# EAGLE schematic untitled (EAGLE 9.6.2)
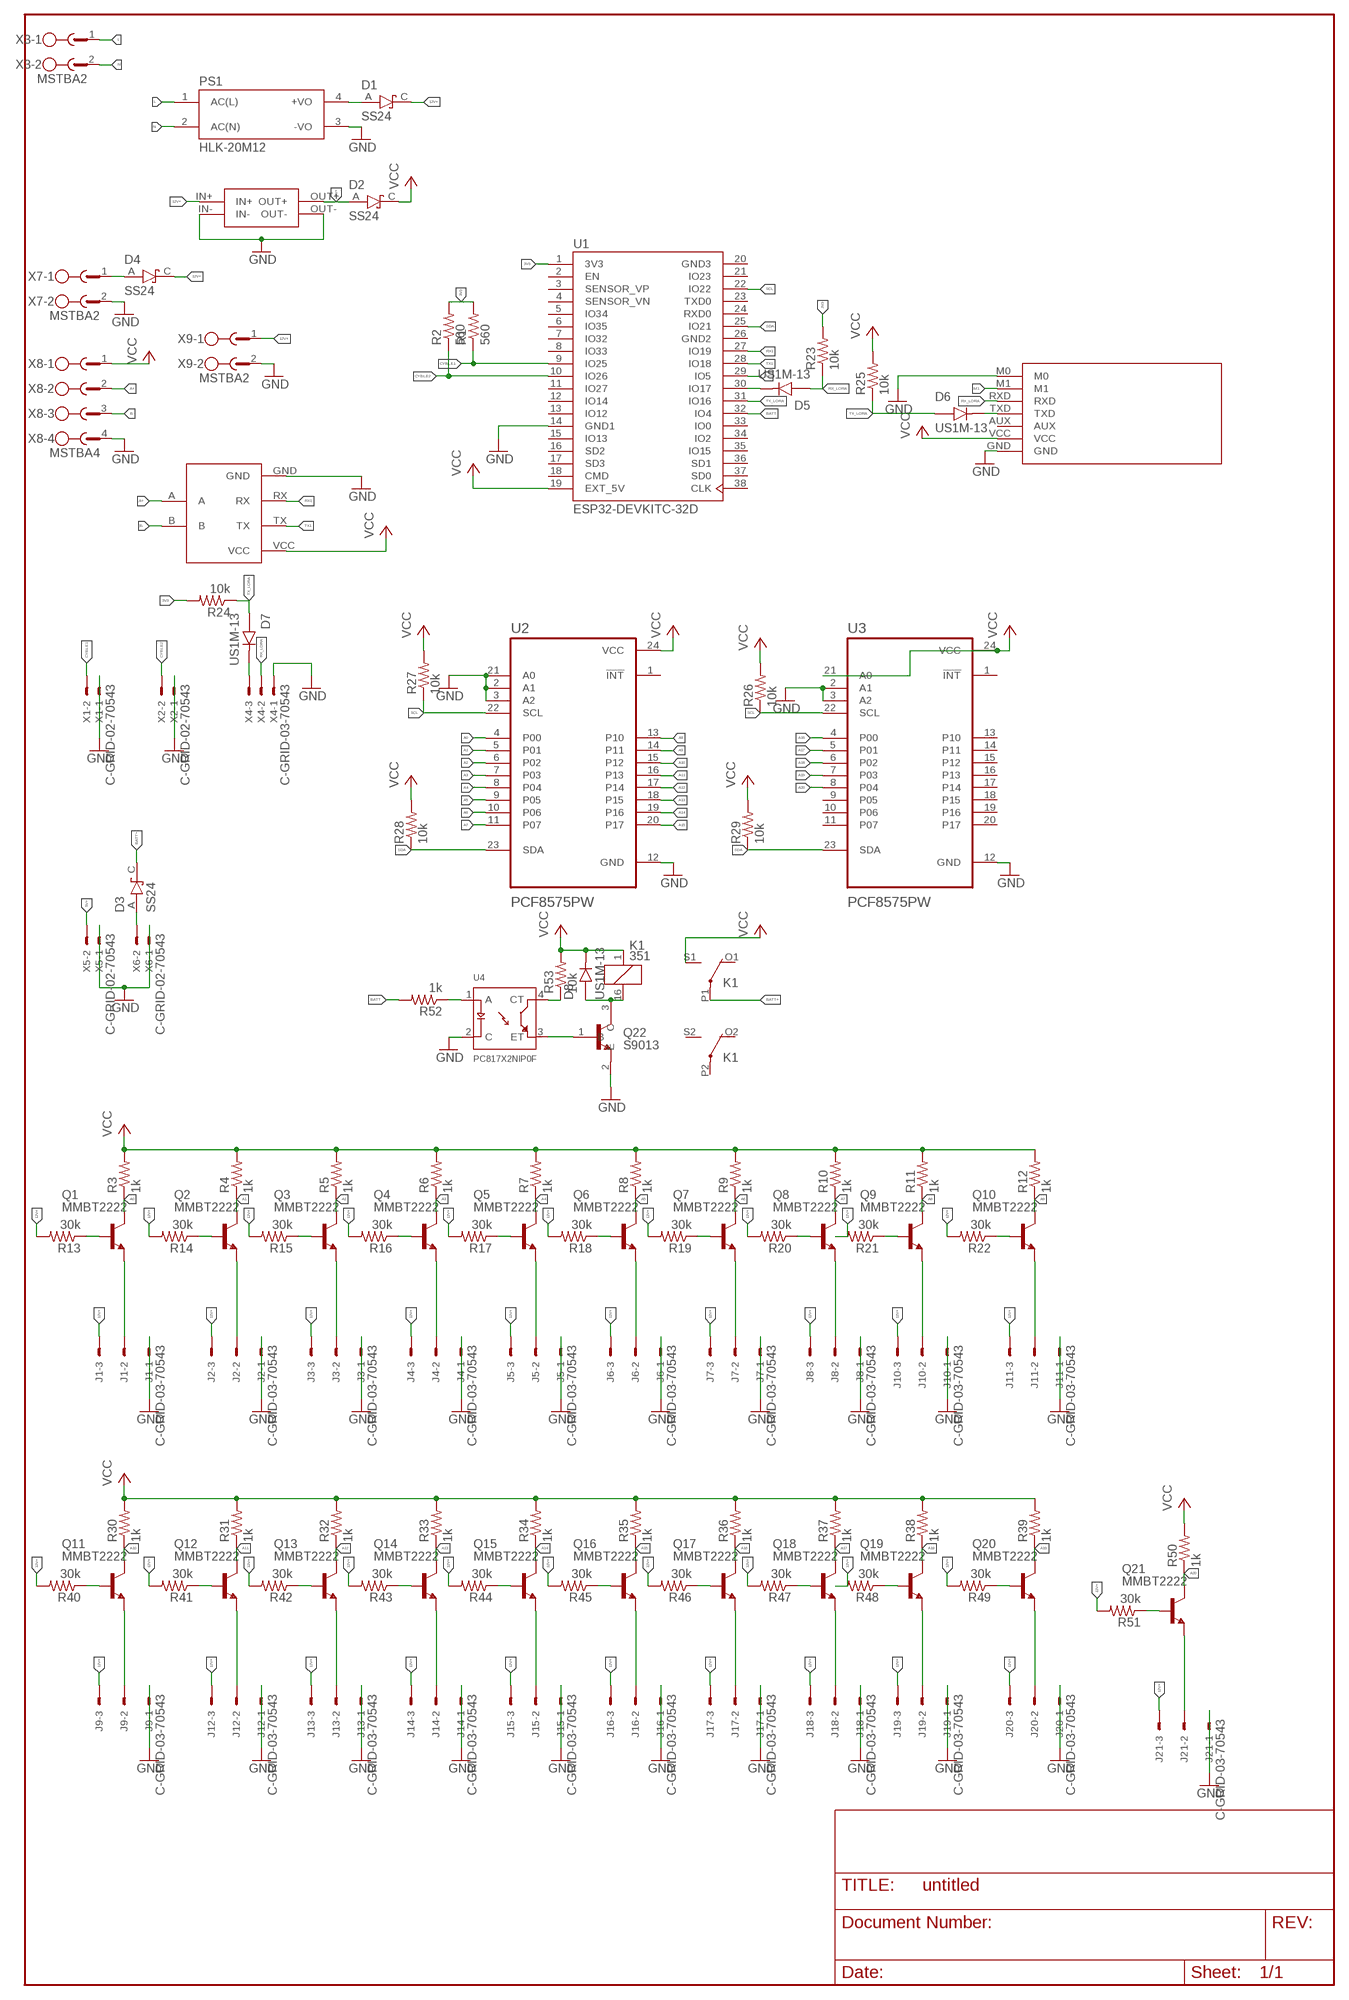
[diagram p0: schematic, sheet 1]

## Parts
D1  SS24  [DIOM5336X265N]
D2  SS24  [DIOM5336X265N]
D3  SS24  [DIOM5336X265N]
D4  SS24  [DIOM5336X265N]
D5  US1M-13  [DIOM5226X240N]
D6  US1M-13  [DIOM5226X240N]
D7  US1M-13  [DIOM5226X240N]
D8  US1M-13  [DIOM5226X240N]
EBYTEE220-900T22D1  EBYTEE220-900T22D  [EBYTEE220-900T22D]
J1  C-GRID-03-70543  [70543-03]
J2  C-GRID-03-70543  [70543-03]
J3  C-GRID-03-70543  [70543-03]
J4  C-GRID-03-70543  [70543-03]
J5  C-GRID-03-70543  [70543-03]
J6  C-GRID-03-70543  [70543-03]
J7  C-GRID-03-70543  [70543-03]
J8  C-GRID-03-70543  [70543-03]
J9  C-GRID-03-70543  [70543-03]
J10  C-GRID-03-70543  [70543-03]
J11  C-GRID-03-70543  [70543-03]
J12  C-GRID-03-70543  [70543-03]
J13  C-GRID-03-70543  [70543-03]
J14  C-GRID-03-70543  [70543-03]
J15  C-GRID-03-70543  [70543-03]
J16  C-GRID-03-70543  [70543-03]
J17  C-GRID-03-70543  [70543-03]
J18  C-GRID-03-70543  [70543-03]
J19  C-GRID-03-70543  [70543-03]
J20  C-GRID-03-70543  [70543-03]
J21  C-GRID-03-70543  [70543-03]
K1  351  [351]
MINI1  MINI560  [MINI560]
PS1  HLK-20M12  [CONV_HLK-20M12]
Q1  MMBT2222  [SOT23-BEC]
Q2  MMBT2222  [SOT23-BEC]
Q3  MMBT2222  [SOT23-BEC]
Q4  MMBT2222  [SOT23-BEC]
Q5  MMBT2222  [SOT23-BEC]
Q6  MMBT2222  [SOT23-BEC]
Q7  MMBT2222  [SOT23-BEC]
Q8  MMBT2222  [SOT23-BEC]
Q9  MMBT2222  [SOT23-BEC]
Q10  MMBT2222  [SOT23-BEC]
Q11  MMBT2222  [SOT23-BEC]
Q12  MMBT2222  [SOT23-BEC]
Q13  MMBT2222  [SOT23-BEC]
Q14  MMBT2222  [SOT23-BEC]
Q15  MMBT2222  [SOT23-BEC]
Q16  MMBT2222  [SOT23-BEC]
Q17  MMBT2222  [SOT23-BEC]
Q18  MMBT2222  [SOT23-BEC]
Q19  MMBT2222  [SOT23-BEC]
Q20  MMBT2222  [SOT23-BEC]
Q21  MMBT2222  [SOT23-BEC]
Q22  S9013  [SOT95P240X120-3N]
R1  560  R-US_M0805  [M0805]
R2  560  R-US_M0805  [M0805]
R3  1k  R-US_M0805  [M0805]
R4  1k  R-US_M0805  [M0805]
R5  1k  R-US_M0805  [M0805]
R6  1k  R-US_M0805  [M0805]
R7  1k  R-US_M0805  [M0805]
R8  1k  R-US_M0805  [M0805]
R9  1k  R-US_M0805  [M0805]
R10  1k  R-US_M0805  [M0805]
R11  1k  R-US_M0805  [M0805]
R12  1k  R-US_M0805  [M0805]
R13  30k  R-US_M0805  [M0805]
R14  30k  R-US_M0805  [M0805]
R15  30k  R-US_M0805  [M0805]
R16  30k  R-US_M0805  [M0805]
R17  30k  R-US_M0805  [M0805]
R18  30k  R-US_M0805  [M0805]
R19  30k  R-US_M0805  [M0805]
R20  30k  R-US_M0805  [M0805]
R21  30k  R-US_M0805  [M0805]
R22  30k  R-US_M0805  [M0805]
R23  10k  R-US_M0805  [M0805]
R24  10k  R-US_M0805  [M0805]
R25  10k  R-US_M0805  [M0805]
R26  10k  R-US_M0805  [M0805]
R27  10k  R-US_M0805  [M0805]
R28  10k  R-US_M0805  [M0805]
R29  10k  R-US_M0805  [M0805]
R30  1k  R-US_M0805  [M0805]
R31  1k  R-US_M0805  [M0805]
R32  1k  R-US_M0805  [M0805]
R33  1k  R-US_M0805  [M0805]
R34  1k  R-US_M0805  [M0805]
R35  1k  R-US_M0805  [M0805]
R36  1k  R-US_M0805  [M0805]
R37  1k  R-US_M0805  [M0805]
R38  1k  R-US_M0805  [M0805]
R39  1k  R-US_M0805  [M0805]
R40  30k  R-US_M0805  [M0805]
R41  30k  R-US_M0805  [M0805]
R42  30k  R-US_M0805  [M0805]
R43  30k  R-US_M0805  [M0805]
R44  30k  R-US_M0805  [M0805]
R45  30k  R-US_M0805  [M0805]
R46  30k  R-US_M0805  [M0805]
R47  30k  R-US_M0805  [M0805]
R48  30k  R-US_M0805  [M0805]
R49  30k  R-US_M0805  [M0805]
R50  1k  R-US_M0805  [M0805]
R51  30k  R-US_M0805  [M0805]
R52  1k  R-US_M0805  [M0805]
R53  10k  R-US_M0805  [M0805]
TTL-RS1  TTL-RS485  [TTL-RS485]
U1  ESP32-DEVKITC-32D  [MODULE_ESP32-DEVKITC-32D]
U2  PCF8575PW  [SOP65P640X120-24N]
U3  PCF8575PW  [SOP65P640X120-24N]
U4  PC817X2NIP0F  [SOT254P975X400-4N]
X1  C-GRID-02-70543  [70543-02]
X2  C-GRID-02-70543  [70543-02]
X3  MSTBA2  [MSTBA2]
X4  C-GRID-03-70543  [70543-03]
X5  C-GRID-02-70543  [70543-02]
X6  C-GRID-02-70543  [70543-02]
X7  MSTBA2  [MSTBA2]
X8  MSTBA4  [MSTBA4]
X9  MSTBA2  [MSTBA2]

## Nets
3V3: R1.2 R2.2 R23.2 R24.2 U1.1(3V3)
5V+: D2.A MINI1.OUT+ X5.2
12V+: D1.C(K) D4.C(K) J1.3 J2.3 J3.3 J4.3 J5.3 J6.3 J7.3 J8.3 J9.3 J10.3 J11.3 J12.3 J13.3 J14.3 J15.3 J16.3 J17.3 J18.3 J19.3 J20.3 J21.3 MINI1.IN+ R13.2 R14.2 R15.2 R16.2 R17.2 R18.2 R19.2 R20.2 R21.2 R22.2 R40.2 R41.2 R42.2 R43.2 R44.2 R45.2 R46.2 R47.2 R48.2 R49.2 R51.2 X9.1
12V++: D1.A PS1.4(+VO)
A0: Q1.C R3.1 U2.4(P00)
A1: Q2.C R4.1 U2.5(P01)
A2: Q3.C R5.1 U2.6(P02)
A3: Q4.C R6.1 U2.7(P03)
A4: Q5.C R7.1 U2.8(P04)
A5: Q6.C R8.1 U2.9(P05)
A6: Q7.C R9.1 U2.10(P06)
A7: Q8.C R10.1 U2.11(P07)
A8: Q9.C R11.1 U2.13(P10)
A9: Q10.C R12.1 U2.14(P11)
A10: Q11.C R30.1 U2.15(P12)
A11: Q12.C R31.1 U2.16(P13)
A12: Q13.C R32.1 U2.17(P14)
A13: Q14.C R33.1 U2.18(P15)
A14: Q15.C R34.1 U2.19(P16)
A15: Q16.C R35.1 U2.20(P17)
A16: Q17.C R36.1 U3.4(P00)
A17: Q18.C R37.1 U3.5(P01)
A18: Q19.C R38.1 U3.6(P02)
A19: Q20.C R39.1 U3.7(P03)
A20: Q21.C R50.1 U3.8(P04)
A+: TTL-RS1.A X8.2
B-: TTL-RS1.B X8.3
BATT: R52.2 U1.32(IO4)
BATT+: D3.C(K) K1.P1(2:P)
CYBLE1: R1.1 U1.9(IO25) X1.2
CYBLE2: R2.1 U1.10(IO26) X2.2
GND: EBYTEE220-900T22D1.GND EBYTEE220-900T22D1.M0 J1.1 J2.1 J3.1 J4.1 J5.1 J6.1 J7.1 J8.1 J9.1 J10.1 J11.1 J12.1 J13.1 J14.1 J15.1 J16.1 J17.1 J18.1 J19.1 J20.1 J21.1 MINI1.IN- MINI1.OUT- PS1.3(-VO) Q22.2(E) TTL-RS1.GND U1.14(GND1) U2.2(A1) U2.3(A2) U2.12(GND) U2.21(A0) U3.2(A1) U3.3(A2) U3.12(GND) U4.2(C) X1.1 X2.1 X4.1 X5.1 X6.1 X7.2 X8.4 X9.2
L: PS1.1(AC(L)) X3.1
M1: EBYTEE220-900T22D1.M1 U1.29(IO5)
N: PS1.2(AC(N)) X3.2
N$1: Q1.B R13.1
N$2: Q2.B R14.1
N$3: D3.A X6.2
N$4: Q3.B R15.1
N$5: Q4.B R16.1
N$6: Q5.B R17.1
N$7: Q6.B R18.1
N$8: Q7.B R19.1
N$9: Q8.B R20.1
N$10: Q9.B R21.1
N$11: Q10.B R22.1
N$12: J1.2 Q1.E
N$13: J2.2 Q2.E
N$14: J3.2 Q3.E
N$15: J4.2 Q4.E
N$16: J5.2 Q5.E
N$17: J6.2 Q6.E
N$18: J7.2 Q7.E
N$19: J8.2 Q8.E
N$20: J10.2 Q9.E
N$21: J11.2 Q10.E
N$22: D4.A X7.1
N$23: D6.C(K) EBYTEE220-900T22D1.TXD
N$24: D5.C(K) U1.30(IO17)
N$25: D7.C(K) X4.3
N$26: Q11.B R40.1
N$27: Q12.B R41.1
N$28: Q13.B R42.1
N$29: Q14.B R43.1
N$30: Q15.B R44.1
N$31: Q16.B R45.1
N$32: Q17.B R46.1
N$33: Q18.B R47.1
N$34: Q19.B R48.1
N$35: Q20.B R49.1
N$36: J9.2 Q11.E
N$37: J12.2 Q12.E
N$38: J13.2 Q13.E
N$39: J14.2 Q14.E
N$40: J15.2 Q15.E
N$41: J16.2 Q16.E
N$42: J17.2 Q17.E
N$43: J18.2 Q18.E
N$44: J19.2 Q19.E
N$45: J20.2 Q20.E
N$46: Q21.B R51.1
N$47: J21.2 Q21.E
N$48: R52.1 U4.1(A)
N$50: R53.1 U4.4(CT)
N$52: D8.A K1.16 Q22.3(C)
N$53: Q22.1(B) U4.3(ET)
RX1: TTL-RS1.RX U1.27(IO19)
RX_LORA: D5.A EBYTEE220-900T22D1.RXD R23.1 X4.2
SCL: R26.1 R27.1 U1.22(IO22) U2.22(SCL) U3.22(SCL)
SDA: R28.1 R29.1 U1.25(IO21) U2.23(SDA) U3.23(SDA)
TX1: TTL-RS1.TX U1.28(IO18)
TX_LORA: D6.A D7.A R24.1 R25.1 U1.31(IO16)
VCC: D2.C(K) D8.C(K) EBYTEE220-900T22D1.VCC K1.1 K1.S1(2:S) R3.2 R4.2 R5.2 R6.2 R7.2 R8.2 R9.2 R10.2 R11.2 R12.2 R25.2 R26.2 R27.2 R28.2 R29.2 R30.2 R31.2 R32.2 R33.2 R34.2 R35.2 R36.2 R37.2 R38.2 R39.2 R50.2 R53.2 TTL-RS1.VCC U1.19(EXT_5V) U2.24(VCC) U3.21(A0) U3.24(VCC) X8.1
Unconnected: EBYTEE220-900T22D1.AUX K1.O1(2:O) K1.O2(3:O) K1.P2(3:P) K1.S2(3:S) U1.2(EN) U1.3(SENSOR_VP) U1.4(SENSOR_VN) U1.5(IO34) U1.6(IO35) U1.7(IO32) U1.8(IO33) U1.11(IO27) U1.12(IO14) U1.13(IO12) U1.15(IO13) U1.16(SD2) U1.17(SD3) U1.18(CMD) U1.21(IO23) U1.23(TXD0) U1.24(RXD0) U1.33(IO0) U1.34(IO2) U1.35(IO15) U1.36(SD1) U1.37(SD0) U1.38(CLK) U2.1(!INT) U3.1(!INT) U3.9(P05) U3.10(P06) U3.11(P07) U3.13(P10) U3.14(P11) U3.15(P12) U3.16(P13) U3.17(P14) U3.18(P15) U3.19(P16) U3.20(P17)

## Power pins joined to a net without a drawn wire
GND2: U1.26(GND2)
GND3: U1.20(GND3)

## Library data of the parts
D1-D4 = SS24:SS24: Diode Schottky 40V 2A Surface Mount DO-214AA (SMB) Check availability <https://pricing.snapeda.com/parts/SS24/ON%20Semiconductor/view-part?ref=eda>; AVAILABILITY: In Stock; CHECK_PRICES: https://www.snapeda.com/parts/SS24/Onsemi/view-part/?ref=eda; DESCRIPTION: Diode Schottky 40V 2A Surface Mount DO-214AA (SMB); MF: ON Semiconductor; MP: SS24; PACKAGE: DO-214AA ON Semiconductor; PRICE: None; SNAPEDA_LINK: https://www.snapeda.com/parts/SS24/Onsemi/view-part/?ref=snap
D5-D8 = US1M-13:US1M-13: Diode, Fast Recovery, 1a, 1kv, Do-214ac-2, Full Reel Check availability <https://pricing.snapeda.com/parts/US1M-13/Diodes%20Incorporated/view-part?ref=eda>; AVAILABILITY: In Stock; DESCRIPTION: Diode Standard 1000 V 1A Surface Mount SMA; MF: Diodes Incorporated; MP: US1M-13; PACKAGE: DO-214AC-214 Diodes Incorporated; PRICE: None; PURCHASE-URL: https://pricing.snapeda.com/search/part/US1M-13/?ref=eda
EBYTEE220-900T22D1 = EByte E220-900T22D:EBYTEE220-900T22D
J1-J21 X4 = con-molex:C-GRID-03: CONNECTOR wire to board 2.54 mm (0.100") pitch header; MF: MOLEX; OC_FARNELL: unknown; OC_NEWARK: unknown
K1 = relay:351: RELAY 2 x switch, Omron; OC_FARNELL: unknown; OC_NEWARK: unknown
MINI1 = MINI560:MINI560
PS1 = HLK-20M12:HLK-20M12: Check availability <https://pricing.snapeda.com/parts/HLK-20M12/Hi-link/view-part?ref=eda>; AVAILABILITY: Not in stock; CHECK_PRICES: https://www.snapeda.com/parts/HLK-20M12/Hi-link/view-part/?ref=eda; DESCRIPTION: 20W ultra-small series module power supply; MF: Hi-link; MP: HLK-20M12; PACKAGE: Non-Standard Hi-link; PRICE: None; SNAPEDA_LINK: https://www.snapeda.com/parts/HLK-20M12/Hi-link/view-part/?ref=snap
Q1-Q21 = MMBT2222_:MMBT2222*: NPN Transistor Check availability <https://pricing.snapeda.com/parts/MMBT2222/ON%20Semiconductor/view-part?ref=eda>; AVAILABILITY: In Stock; CHECK_PRICES: https://www.snapeda.com/parts/MMBT2222/Onsemi/view-part/?ref=eda; DESCRIPTION: Bipolar (BJT) Transistor NPN 30 V 600 mA 250MHz 300 mW Surface Mount SOT-23-3 (TO-236); MF: ON Semiconductor; MP: MMBT2222; PACKAGE: SOT-23-3 Fairchild Semiconductor; PRICE: None; SNAPEDA_LINK: https://www.snapeda.com/parts/MMBT2222/Onsemi/view-part/?ref=snap
Q22 = S9013:S9013: SMD Transistors NPN 25V-500mA Check availability <https://pricing.snapeda.com/parts/S9013/JCET/view-part?ref=eda>; AVAILABILITY: In Stock; DESCRIPTION: Bipolar (BJT) Transistor NPN 20V 500mA 625mW Through Hole TO-92-3; MF: JCET; MP: S9013; PACKAGE: SOT-23-3 JCET; PRICE: None; PURCHASE-URL: https://pricing.snapeda.com/search/part/S9013/?ref=eda
R1-R53 = rcl:R-US_: RESISTOR, American symbol; SPICEPREFIX: R
TTL-RS1 = TTL-RS485:TTL-RS485
U1 = ESP32-DEVKITC-32D:ESP32-DEVKITC-32D: Eval Board For Esp-Wroom-32 Check availability <https://pricing.snapeda.com/parts/ESP32-DEVKITC-32D/Espressif%20Systems/view-part?ref=eda>; AVAILABILITY: In Stock; DESCRIPTION: WiFi Development Tools (802.11) ESP32 General Development Kit, ESP32-WROOM-32D on the board; MF: Espressif Systems; MP: ESP32-DEVKITC-32D; PACKAGE: None; PRICE: None; PURCHASE-URL: https://pricing.snapeda.com/search/part/ESP32-DEVKITC-32D/?ref=eda
U2 U3 = PCF8575PW:PCF8575PW: Check availability <https://pricing.snapeda.com/parts/PCF8575PW/Texas%20Instruments/view-part?ref=eda>; AVAILABILITY: In Stock; CHECK_PRICES: https://www.snapeda.com/parts/PCF8575PW/Texas+Instruments/view-part/?ref=eda; DESCRIPTION: 16-bit 2.5- to 5.5-V I2C/SMBus I/O expander with interrupt; MF: Texas Instruments; MP: PCF8575PW; PACKAGE: TSSOP-24 Texas Instruments; PRICE: None; PURCHASE-URL: https://www.snapeda.com/api/url_track_click_mouser/?unipart_id=1203644&manufacturer=Texas Instruments&part_name=PCF8575PW&search_term=pcf8575; SNAPEDA_LINK: https://www.snapeda.com/parts/PCF8575PW/Texas+Instruments/view-part/?ref=snap
U4 = PC817X2NIP0F:PC817X2NIP0F: PC817 Series 1 Channel 80 V 5000 Vrms General Purpose Photocoupler - DIP-4 Check availability <https://pricing.snapeda.com/parts/PC817X2NIP0F/Sharp%20Microelectronics/view-part?ref=eda>; AVAILABILITY: Not in stock; DESCRIPTION: Optoisolator Transistor Output 5000Vrms 1 Channel 4-SMD; MF: Sharp Microelectronics; MP: PC817X2NIP0F; PACKAGE: SMD-4 Sharp Microelectronics; PRICE: None
X1 X2 X5 X6 = con-molex:C-GRID-02: CONNECTOR wire to board 2.54 mm (0.100") pitch header; MF: MOLEX; OC_FARNELL: unknown; OC_NEWARK: unknown
X3 X7 X9 = con-phoenix-508:MSTBA2: PHOENIX; MF: FARNELL; MPN: 1757242; OC_FARNELL: 3705171; OC_NEWARK: 71C4161
X8 = con-phoenix-508:MSTBA4: PHOENIX; MF: FARNELL; MPN: 1757268; OC_FARNELL: 3705195; OC_NEWARK: 71C4163